# Altium project Arm_Control_Board.PrjPcb (part 1 of 2)
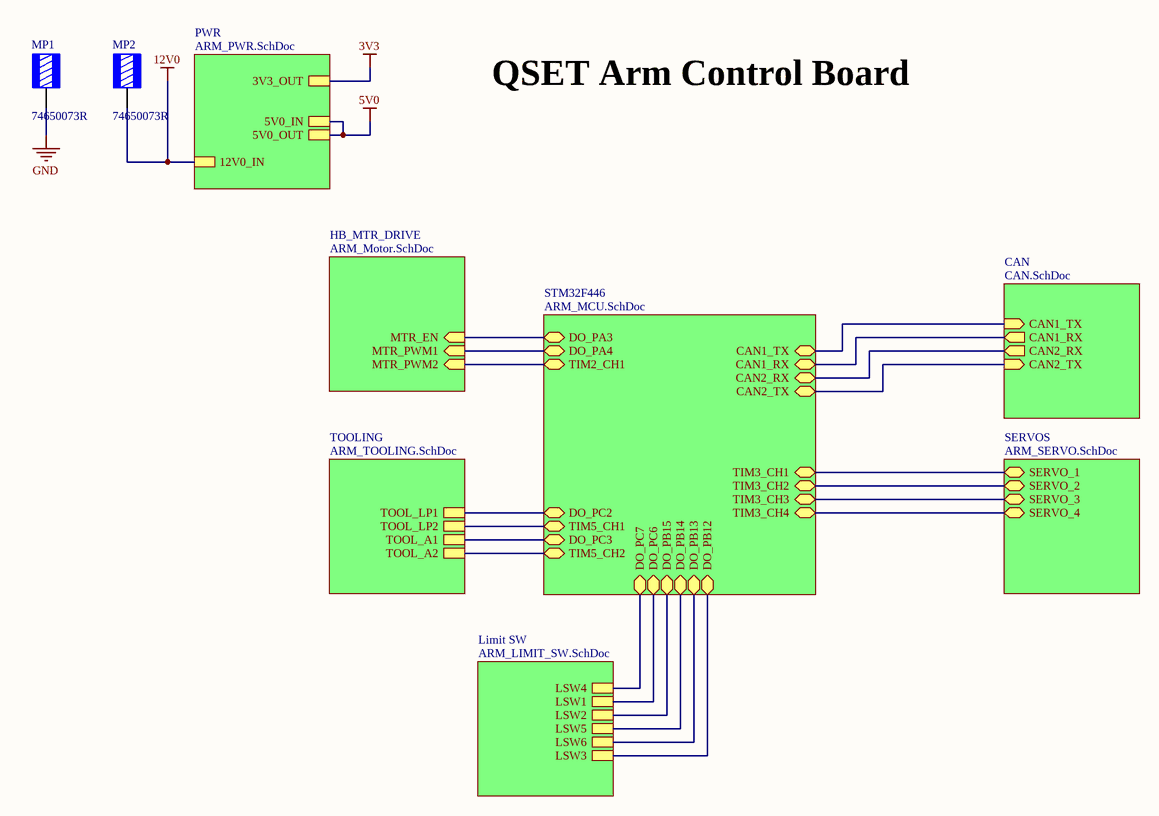
[diagram p0: TOP.SchDoc]
Project: ARM Control Board
9 sheets, 130 parts. Net scope: hierarchical (ports join the sheet entries above them; power ports are global).
Board file: Arm_Control_Board.PcbDoc
Sheets:
  TOP.SchDoc
    STM32F446 = ARM_MCU.SchDoc
      USBC = USBC.SchDoc
    HB_MTR_DRIVE = ARM_Motor.SchDoc
    SERVOS = ARM_SERVO.SchDoc
    PWR = ARM_PWR.SchDoc
    CAN = CAN.SchDoc
    TOOLING = ARM_TOOLING.SchDoc
    Limit SW = ARM_LIMIT_SW.SchDoc

## Sheet TOP.SchDoc: Title
size A4; Date: *******; ApprovedBy: *******; CheckedBy: None; Author: *******; CompanyName: *******; DrawnBy: Jacob Chisholm; Engineer: *******; Organization: *******; Address1: *******; Address2: *******; Address3: *******; Address4: *******; DocumentNumber: 1; Revision: *******; SheetNumber: 1; SheetTotal: 9; Address_Website: https://jchisholm204.github.io; E-Mail: JacobChisholm1010@gmail.com; CurrentTime: *******; CurrentDate: *******; Time: *******; DocumentFullPathAndName: *******; DocumentName: *******; ModifiedDate: *******; ImagePath: *******; ProjectName: *******; Application_BuildNumber: *******

### Parts
MP1  74650073R  [WURTH 74650073]
MP2  74650073R  [WURTH 74650073]

### Sub-sheets
CAN = CAN.SchDoc: CAN1_TX (in), CAN1_RX (out), CAN2_TX (in), CAN2_RX (out)
HB_MTR_DRIVE = ARM_Motor.SchDoc: MTR_EN (in), MTR_PWM1 (in), MTR_PWM2 (in)
Limit SW = ARM_LIMIT_SW.SchDoc: LSW1, LSW3, LSW5, LSW2, LSW4, LSW6
PWR = ARM_PWR.SchDoc: 3V3_OUT, 5V0_IN, 12V0_IN, 5V0_OUT
SERVOS = ARM_SERVO.SchDoc: SERVO_1 (bidir), SERVO_2 (bidir), SERVO_3 (bidir), SERVO_4 (bidir)
STM32F446 = ARM_MCU.SchDoc: TIM5_CH1 (bidir), TIM5_CH2 (bidir), DO_PA3 (bidir), DO_PA4 (bidir), DO_PC6 (bidir), DO_PC7 (bidir), DO_PB15 (bidir), DO_PB14 (bidir), TIM3_CH3 (bidir), TIM3_CH4 (bidir), CAN1_RX (bidir), CAN1_TX (bidir), DO_PB13 (bidir), TIM3_CH2 (bidir), DO_PB12 (bidir), CAN2_RX (bidir), CAN2_TX (bidir), TIM3_CH1 (bidir), TIM2_CH1 (bidir), DO_PC2 (bidir), DO_PC3 (bidir)
TOOLING = ARM_TOOLING.SchDoc: TOOL_LP1, TOOL_LP2, TOOL_A1, TOOL_A2

### Nets
5V0: sheet PWR/5V0_IN, sheet PWR/5V0_OUT
12V0: MP2.1 ; sheet PWR/12V0_IN  [project net 12V_IN]
GND: MP1.1
\: sheet STM32F446/DO_PC7, sheet Limit SW/LSW4
CAN1_RX: sheet STM32F446/CAN1_RX, sheet CAN/CAN1_RX
CAN1_TX: sheet STM32F446/CAN1_TX, sheet CAN/CAN1_TX
CAN2_RX: sheet STM32F446/CAN2_RX, sheet CAN/CAN2_RX
CAN2_TX: sheet STM32F446/CAN2_TX, sheet CAN/CAN2_TX
DO_PA3: sheet STM32F446/DO_PA3, sheet HB_MTR_DRIVE/MTR_EN
DO_PA4: sheet STM32F446/DO_PA4, sheet HB_MTR_DRIVE/MTR_PWM1
DO_PB12: sheet STM32F446/DO_PB12, sheet Limit SW/LSW3
DO_PB13: sheet STM32F446/DO_PB13, sheet Limit SW/LSW6
DO_PB14: sheet STM32F446/DO_PB14, sheet Limit SW/LSW5
DO_PB15: sheet STM32F446/DO_PB15, sheet Limit SW/LSW2
DO_PC2: sheet STM32F446/DO_PC2, sheet TOOLING/TOOL_LP1
DO_PC3: sheet STM32F446/DO_PC3, sheet TOOLING/TOOL_A1
DO_PC6: sheet STM32F446/DO_PC6, sheet Limit SW/LSW1
TIM2_CH2: sheet STM32F446/TIM2_CH1, sheet HB_MTR_DRIVE/MTR_PWM2
TIM3_CH1: sheet STM32F446/TIM3_CH1, sheet SERVOS/SERVO_1
TIM3_CH2: sheet STM32F446/TIM3_CH2, sheet SERVOS/SERVO_2
TIM3_CH3: sheet STM32F446/TIM3_CH3, sheet SERVOS/SERVO_3
TIM3_CH4: sheet STM32F446/TIM3_CH4, sheet SERVOS/SERVO_4
TIM5_CH1: sheet STM32F446/TIM5_CH1, sheet TOOLING/TOOL_LP2
TIM5_CH2: sheet STM32F446/TIM5_CH2, sheet TOOLING/TOOL_A2

### Notes on the sheet
- QSET Arm Control Board
- Title:
- Drawn By:
- Page Contents:
- Checked By:
- Size:
- Date:
- File:
- License:
- Email:
- A4
- Number:
- Time:
- Revision:
- Sheet
- Website:
- of

### Library data of the parts
MP1 MP2 = 74650073R: TERM REDCUBE M3 4PIN PCB; Manufacturer: Würth Elektronik; Current Rating (Amps): 50 A; Part Number: 74650073R; ComponentLink1Description: Datasheet; ComponentLink1URL: https://katalog.we-online.de/em/datasheet/74650073R.pdf; ComponentLink2Description: DigiKey Link; ComponentLink2URL: https://www.digikey.com/en/products/detail/würth-elektronik/74650073R/6643978; Features: Screw not Included; LastUpdated: 8/7/2022 8:38:54 PM; Lifecycle Status: Active; Minimum Order: 1; Mounting Type: Through Hole; Number of Pins: 4; Packaging: TapeAndReel; Part Status: Active; Price: 2.28; Screw Size: M3; Series: REDCUBE WP-THRBU; Supplier 1: DigiKey; Supplier Part Number 1: 732-10882-1-ND; Terminal Type: Screw Terminal, Power Tap; Termination: Solder

## Sheet ARM_MCU.SchDoc: Title
size A4; Date: *******; ApprovedBy: *******; CheckedBy: None; Author: *******; CompanyName: *******; DrawnBy: Jacob Chisholm; Engineer: *******; Organization: *******; Address1: *******; Address2: *******; Address3: *******; Address4: *******; DocumentNumber: 2; Revision: *******; SheetNumber: 2; SheetTotal: 9; Address_Website: https://jchisholm204.github.io; E-Mail: JacobChisholm1010@gmail.com; CurrentTime: *******; CurrentDate: *******; Time: *******; DocumentFullPathAndName: *******; DocumentName: *******; ModifiedDate: *******; ImagePath: *******; ProjectName: *******; Application_BuildNumber: *******
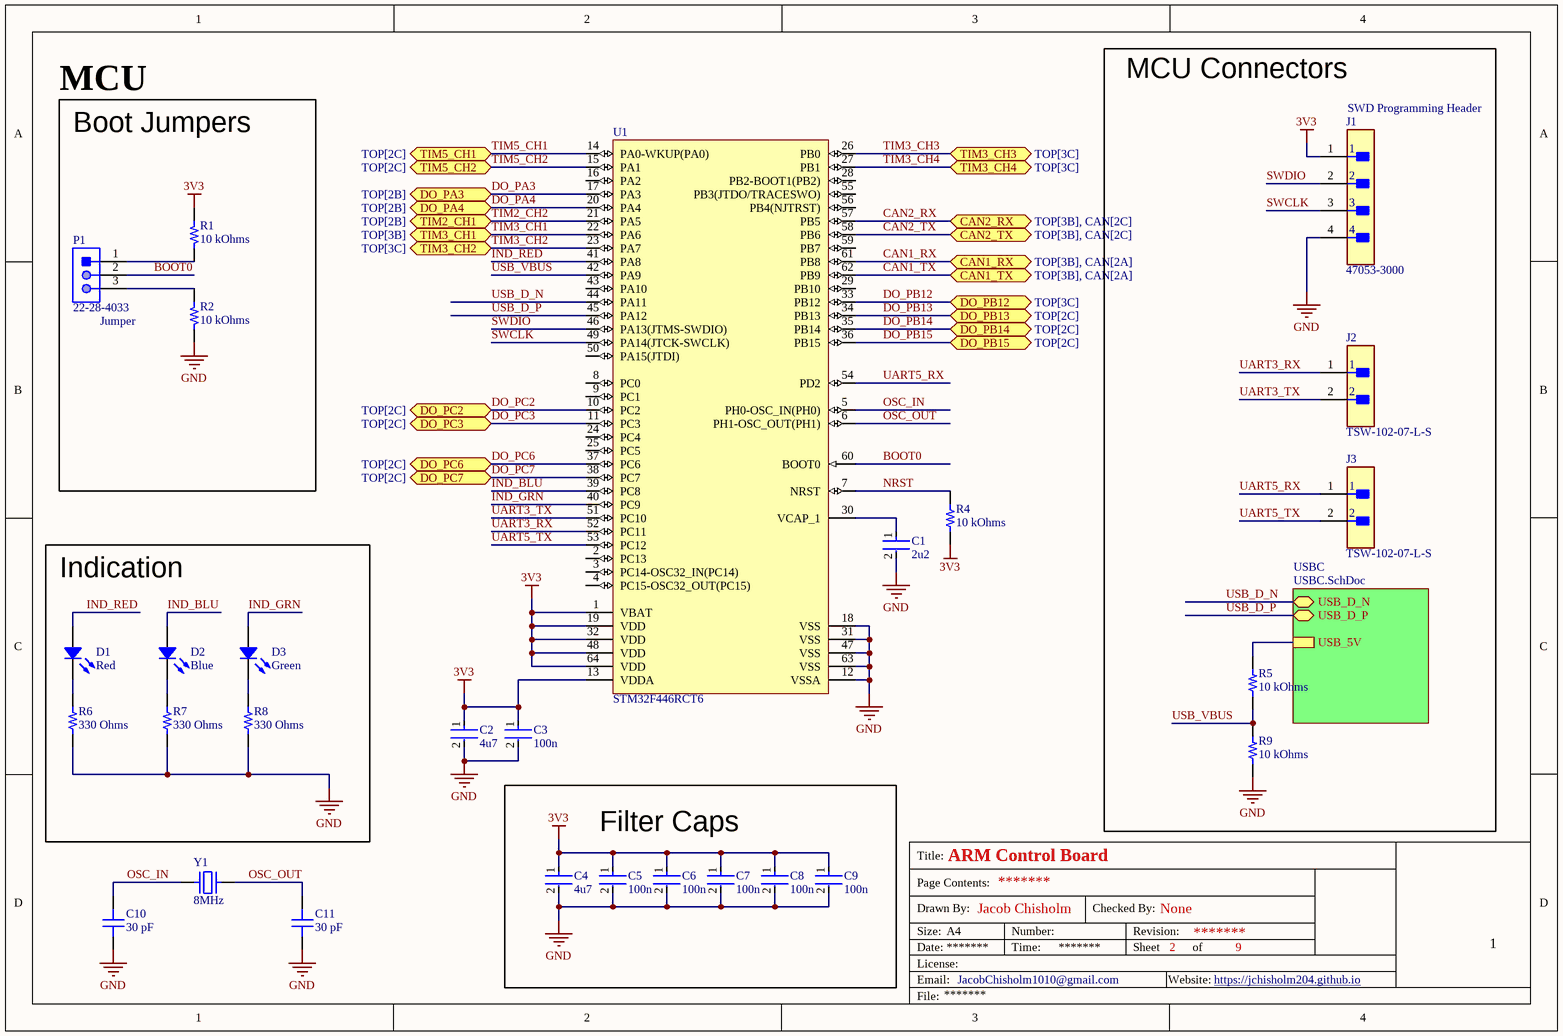
[diagram p1: ARM_MCU.SchDoc]

### Parts
C1  2u2  [FP-CL10-IPC_C]
C2  4u7  [FP-CL10-IPC_C]
C3  100n  [FP-CL779-IPC_C]
C4  4u7  [FP-CL10-IPC_C]
C5  100n  [FP-CL779-IPC_C]
C6  100n  [FP-CL779-IPC_C]
C7  100n  [FP-CL779-IPC_C]
C8  100n  [FP-CL779-IPC_C]
C9  100n  [FP-CL779-IPC_C]
C10  30 pF  [CAP 0603_1608]
C11  30 pF  [CAP 0603_1608]
D1  Red  [LED 0603_1608 RED]
D2  Blue  [LED 0603_1608 BLUE]
D3  Green  [LED 0603_1608 GREEN]
J1  47053-3000  [FP-47053-3000-MFG]
J2  TSW-102-07-L-S  [FP-TSW-102-07-L-S-MFG]
J3  TSW-102-07-L-S  [FP-TSW-102-07-L-S-MFG]
P1  22-28-4033  [MOLX-22-28-4033_V]
R1  10 kOhms  [RES 0603_1608]
R2  10 kOhms  [RES 0603_1608]
R4  10 kOhms  [RES 0603_1608]
R5  10 kOhms  [RES 0603_1608]
R6  330 Ohms  [RES 0603_1608]
R7  330 Ohms  [RES 0603_1608]
R8  330 Ohms  [RES 0603_1608]
R9  10 kOhms  [RES 0603_1608]
U1  STM32F446RCT6  [STM-LQFP64_L]
Y1  8MHz  [TXC 9C]

### Blocks framed on the sheet
MCU Connectors: J1-J3 R5 R9
MCU: P1 R1 R2
Indication: D1-D3 R6-R8
Filter Caps: C4-C9

### Sub-sheets
USBC = USBC.SchDoc: USB_D_N (bidir), USB_D_P (bidir), USB_5V

### Ports
CAN1_RX (bidir, see TOP[3B], CAN[2A]), CAN1_TX (bidir, see TOP[3B], CAN[2A]), CAN2_RX (bidir, see TOP[3B], CAN[2C]), CAN2_TX (bidir, see TOP[3B], CAN[2C]), DO_PA3 (bidir, see TOP[2B]), DO_PA4 (bidir, see TOP[2B]), DO_PB12 (bidir, see TOP[3C]), DO_PB13 (bidir, see TOP[2C]), DO_PB14 (bidir, see TOP[2C]), DO_PB15 (bidir, see TOP[2C]), DO_PC2 (bidir, see TOP[2C]), DO_PC3 (bidir, see TOP[2C]), DO_PC6 (bidir, see TOP[2C]), DO_PC7 (bidir, see TOP[2C]), TIM2_CH1 (bidir, see TOP[2B]), TIM3_CH1 (bidir, see TOP[3B]), TIM3_CH2 (bidir, see TOP[3C]), TIM3_CH3 (bidir, see TOP[3C]), TIM3_CH4 (bidir, see TOP[3C]), TIM5_CH1 (bidir, see TOP[2C]), TIM5_CH2 (bidir, see TOP[2C])

### Nets
3V3: C2.1 C3.1 C4.1 C5.1 C6.1 C7.1 C8.1 C9.1 J1.1 R1.1 R4.1 U1.1(VBAT) U1.13(VDDA) U1.19(VDD) U1.32(VDD) U1.48(VDD) U1.64(VDD)
GND: C1.2 C2.2 C3.2 C4.2 C5.2 C6.2 C7.2 C8.2 C9.2 C10.1 C11.1 J1.4 R2.1 R6.1 R7.1 R8.1 R9.1 U1.12(VSSA) U1.18(VSS) U1.31(VSS) U1.47(VSS) U1.63(VSS)
BOOT0: P1.2 U1.60(BOOT0)
CAN1_RX: U1.61(PB8) ; port CAN1_RX
CAN1_TX: U1.62(PB9) ; port CAN1_TX
CAN2_RX: U1.57(PB5) ; port CAN2_RX
CAN2_TX: U1.58(PB6) ; port CAN2_TX
DO_PA3: U1.17(PA3) ; port DO_PA3
DO_PA4: U1.20(PA4) ; port DO_PA4
DO_PB12: U1.33(PB12) ; port DO_PB12
DO_PB13: U1.34(PB13) ; port DO_PB13
DO_PB14: U1.35(PB14) ; port DO_PB14
DO_PB15: U1.36(PB15) ; port DO_PB15
DO_PC2: U1.10(PC2) ; port DO_PC2
DO_PC3: U1.11(PC3) ; port DO_PC3
DO_PC6: U1.37(PC6) ; port DO_PC6
DO_PC7: U1.38(PC7) ; port DO_PC7  [project net \]
IND_BLU: D2.1 U1.39(PC8)
IND_GRN: D3.1 U1.40(PC9)
IND_RED: D1.1 U1.41(PA8)
NRST: R4.2 U1.7(NRST)
OSC_IN: C10.2 U1.5(PH0-OSC_IN(PH0)) Y1.1
OSC_OUT: C11.2 U1.6(PH1-OSC_OUT(PH1)) Y1.2
SWCLK: J1.3 U1.49(PA14(JTCK-SWCLK))
SWDIO: J1.2 U1.46(PA13(JTMS-SWDIO))
TIM2_CH2: U1.21(PA5) ; port TIM2_CH1
TIM3_CH1: U1.22(PA6) ; port TIM3_CH1
TIM3_CH2: U1.23(PA7) ; port TIM3_CH2
TIM3_CH3: U1.26(PB0) ; port TIM3_CH3
TIM3_CH4: U1.27(PB1) ; port TIM3_CH4
TIM5_CH1: U1.14(PA0-WKUP(PA0)) ; port TIM5_CH1
TIM5_CH2: U1.15(PA1) ; port TIM5_CH2
UART3_RX: J2.1 U1.52(PC11)
UART3_TX: J2.2 U1.51(PC10)
UART5_RX: J3.1 U1.54(PD2)
UART5_TX: J3.2 U1.53(PC12)
USB_D_N: U1.44(PA11) ; sheet USBC/USB_D_N
USB_D_P: U1.45(PA12) ; sheet USBC/USB_D_P
USB_VBUS: R5.1 R9.2 U1.42(PA9)
NetC1_1: C1.1 U1.30(VCAP_1)
NetD1_2: D1.2 R6.2
NetD2_2: D2.2 R7.2
NetD3_2: D3.2 R8.2
NetJ4_A4: R5.2 ; sheet USBC/USB_5V
NetP1_1: P1.1 R1.2
NetP1_3: P1.3 R2.2

Not connected (* = marked no-connect by the designer): U1 2(PC13) 3(PC14-OSC32_IN(PC14)) 4(PC15-OSC32_OUT(PC15)) 8(PC0) 9(PC1) 16(PA2) 24(PC4) 25(PC5) 28(PB2-BOOT1(PB2)) 29(PB10) 43(PA10) 50(PA15(JTDI)) 55(PB3(JTDO/TRACESWO)) 56(PB4(NJTRST)) 59(PB7)

### Notes on the sheet
- (near J1) SWD Programming Header
- Boot Jumpers
- (near P1) Jumper
- 1
- Title:
- Drawn By:
- Page Contents:
- Checked By:
- Size:
- Date:
- File:
- License:
- Email:
- A4
- Number:
- Time:
- Revision:
- Sheet
- Website:
- of

### Library data of the parts
C1 C2 C4 = CMP-13271-003017-1: Cap Ceramic 4.7uF 10V X5R ±10% Pad SMD 0603 +85°C T/R; Capacitance: 4.7uF; Case/Package: 0603; Packaging: Tape and Reel; Width: 0.031inch; Contact Plating: Tin; Thickness: 0.035inch; Package Quantity: 1; Voltage Rating: 10V; Case Code (Metric): 1608; Case Code (Imperial): 0603; Depth: 0.8mm; Height: 0.8mm; Tolerance: 10%; Max Operating Temperature: 85°C; Length: 1.6mm; Dielectric: X5R; Mount: Surface Mount; Radiation Hardening: No; Min Operating Temperature: -55°C
C3 C5-C9 = CMP-13271-002336-1: Cap Ceramic 100nF 50V X7R ±10% SMD 0402 +125°C Paper T/R
C10 C11 = 0603N300J500CT: CAP CER 30PF 50V C0G/NP0 0603; manufacturer: Walsin Technology Corporation; Temperature Coefficient: C0G, NP0; Tolerance: ±5%; Part Number: 0603N300J500CT; Value: 30 pF; Applications: General Purpose; Capacitance: 30 pF; componentlink1description: Datasheet; componentlink1url: http://www.passivecomponent.com/wp-content/uploads/2018/10/MLCC.pdf; componentlink2description: DigiKey Link; componentlink2url: https://www.digikey.com/en/products/detail/walsin-technology-corporation/0603N300J500CT/9355012; Device Package: 0603 (1608 Metric); lastupdated: 2/9/2024 8:10:20 PM; Lifecycle Status: Active; Minimum Order: 1; Mounting Type: Surface Mount, MLCC; Operating Temperature: -55°C ~ 125°C; Package / Case: 0603 (1608 Metric); packaging: TapeAndReel; partid: 9974; Part Status: Active; price: 0.01; series: -; Size / Dimension: 0.063" L x 0.031" W (1.60mm x 0.80mm); Supplier 1: DigiKey; Supplier Part Number 1: 1292-1515-1-ND; Thickness (Max): 0.034" (0.87mm); Voltage - Rated: 50V
D1 = 19-213SDRC/S259/TR8: LED RED CLEAR 2SMD; Manufacturer: Everlight Electronics Co Ltd; Configuration: Standard; Current - Test: 10mA; Lens Color: Colorless; Lens Size: 1.20mm x 0.80mm; Lens Style: Rectangle with Flat Top; Viewing Angle: 120°; Voltage - Forward (Vf) (Typ): 2V; Wavelength - Peak: 650nm; Part Number: 19-213SDRC/S259/TR8; Color: Red; ComponentLink1Description: Datasheet; ComponentLink1URL: //media.digikey.com/pdf/Data%20Sheets/Everlight%20PDFs/19-213SDRC-S259-TR8.pdf; ComponentLink2Description: DigiKey Link; ComponentLink2URL: http://digikey.com/product-detail/en/everlight-electronics-co-ltd/19-213SDRC-S259-TR8/1080-1580-1-ND/8535303; Device Package: 0603 (1608 Metric); Height (Max): 0.70mm; LastUpdated: 6/3/2024 7:59:48 PM; Lens Transparency: Clear; Lifecycle Status: Active; Minimum Order: 1; Mounting Type: Surface Mount; Package / Case: 0603 (1608 Metric); Packaging: TapeAndReel; PartId: 372; Part Status: Active; Price: 0.06; Series: -; Size / Dimension: 1.60mm L x 0.80mm W; Supplier 1: DigiKey; Supplier Part Number 1: 1080-1580-1-ND; Supplier Device Package: 2-SMD; Value: Red
D2 = 19-213SUBC/S400-A5/S208-2/TR8: LED BLUE CLEAR 2SMD; Manufacturer: Everlight Electronics Co Ltd; Configuration: Standard; Current - Test: 5mA; Lens Color: Colorless; Lens Size: 1.20mm x 0.80mm; Lens Style: Rectangle with Flat Top; Viewing Angle: 120°; Voltage - Forward (Vf) (Typ): 2.9V; Wavelength - Peak: 468nm; Part Number: 19-213SUBC/S400-A5/S208-2/TR8; Color: Blue; ComponentLink1Description: Datasheet; ComponentLink1URL: //media.digikey.com/pdf/Data%20Sheets/Everlight%20PDFs/19-213SUBC-S400-A5-S208-2-TR8.pdf; ComponentLink2Description: DigiKey Link; ComponentLink2URL: https://www.digikey.com/en/products/detail/everlight-electronics-co-ltd/19-213SUBC-S400-A5-S208-2-TR8/8535275; Device Package: 0603 (1608 Metric); Height (Max): 0.70mm; LastUpdated: 6/3/2024 7:57:52 PM; Lens Transparency: Clear; Lifecycle Status: Active; Minimum Order: 1; Mounting Type: Surface Mount; Package / Case: 0603 (1608 Metric); Packaging: TapeAndReel; PartId: 808; Part Status: Active; Price: 0.05; Series: -; Size / Dimension: 1.60mm L x 0.80mm W; Supplier 1: DigiKey; Supplier Part Number 1: 1080-1581-1-ND; Supplier Device Package: 2-SMD; Value: Blue
D3 = 150060GS55040: LED GREEN DIFFUSED 0603 SMD; Manufacturer: Würth Elektronik; Configuration: Standard; Current - Test: 20mA; Lens Color: 0.50mm; Lens Size: 1.00mm x 0.80mm; Lens Style: Rectangle with Flat Top; Millicandela Rating: 430mcd; Viewing Angle: 140°; Voltage - Forward (Vf) (Typ): 3.2V; Wavelength - Dominant: 525nm; Wavelength - Peak: 520nm; Part Number: 150060GS55040; Color: Green; ComponentLink1Description: Datasheet; ComponentLink1URL: https://www.we-online.de/web/en/index.php/download/media/07_electronic_components/download_center_1/application_notes_berichte/ano002_leds___the_future_of_horticultural_lighting/ANO002b_EN_LEDs_The_Future_of_Horticultural_Lighting.pdf; ComponentLink2Description: DigiKey Link; ComponentLink2URL: https://www.digikey.com/en/products/detail/würth-elektronik/150060GS55040/8557179; Device Package: 0603 (1608 Metric); Height (Max): 0.50mm; LastUpdated: 6/3/2024 7:58:52 PM; Lens Transparency: Diffused; Lifecycle Status: Active; Minimum Order: 1; Mounting Type: Surface Mount; Package / Case: 0603 (1608 Metric); Packaging: TapeAndReel; PartId: 673; Part Status: Active; Price: 0.14; Series: WL-SMCD; Size / Dimension: 1.60mm L x 0.80mm W; Supplier 1: DigiKey; Supplier Part Number 1: 732-12014-1-ND; Supplier Device Package: 0603 (1608 Metric); Value: Green
J1 = CMP-04776-000447-1: CONN HEADER VERT 4POS 2.54MM; Glow Wire Compliant: Non-compliant; Voltage Rating: 250V; Current Rating: 4A; Number of Circuits: 4; Gender: Male; Orientation: Straight; Packaging: Bulk; Series: 47053; RoHS Compliant: Yes; Termination: Through Hole; Contact Plating: Tin; Mount: Through Hole; Number of Rows: 1; Pitch: 2.54mm; Halogen Free: Low Halogen; Number of Contacts: 4; Min Operating Temperature: 0°C; Package Quantity: 12000; Contact Material: Copper Alloy; Max Operating Temperature: 75°C; REACH SVHC: No SVHC; Number of Positions: 4
J2 J3 = CMP-02766-001428-1: CONN HEADER VERT 2POS 2.54MM; Voltage Rating: 550V; Current Rating: 7.6A; Gender: Male; Number of Contacts: 2; Connector Type: Male Pin; Radiation Hardening: No; Orientation: Straight; Contact Plating: Gold; Max Operating Temperature: 125°C; Mount: Through Hole; Package Quantity: 1; Number of Rows: 1; Housing Material: Polyester; RoHS Compliant: Yes; Length: 5.08mm; Max Voltage Rating (AC): 550V; Pitch: 2.54mm; Packaging: Bulk; Depth: 2.54mm; Termination: Solder; Min Operating Temperature: -55°C; Housing Color: Black; Lead Free: Lead Free; Color: Black; Number of Positions: 2; Width: 2.54mm; Max Current Rating: 7.6A; REACH SVHC: No SVHC; Contact Material: Bronze; Contact Mating Length: 0.23inch; Series: TSW; Contact Type: Male Pin
P1 = CMP-1676-00001-5: Male Header, Pitch 2.54 mm, 1 x 3 Position, Height 8.38 mm, Tail Length 3.18 mm, RoHS, Bulk; Manufacturer: Molex; Rows: 1; Voltage Rating: 250 V; Current Rating: 4 A; Min Operating Temperature: 0 degC; Lead Pitch: 0.1 inch; Packaging: Bulk; Contact Finish: Gold; RoHSCompliant: true; Contact Material: Brass; PackageReference: 22-28-4033; REACH SVHC: Unknown; PackageDescription: Male Header, Pitch 2.54 mm, 1 x 3 Position, Height 8.38 mm, Tail Length 3.18 mm; ComponentLink2URL: http://www.molex.com/pdm_docs/sd/022284033_sd.pdf; Height: 8.38 mm; Mounting Technology: Through Hole; ComponentLink1Description: Manufacturer URL; Length: 7.62 mm; Mount: Through Hole; DatasheetVersion: Rev. G, 01/2012; Max Operating Temperature: 75 degC; ComponentLink2Description: Datasheet; Colour: Black; Pins: 3; Contact Plating: Gold; Package Quantity: 1; ComponentLink1URL: http://www.molex.com/
R1 R2 R4 = P2TC0603D1002LNTA: P2TC0603 2PPM/C 10K 0,01% N TA; Manufacturer: Vishay Sfernice; Power (Watts): 0.125W, 1/8W; Temperature Coefficient: ±2ppm/°C; Tolerance: ±0.01%; Part Number: P2TC0603D1002LNTA; Value: 10 kOhms; ComponentLink1Description: Datasheet; ComponentLink1URL: https://www.vishay.com/docs/53080/p2tc.pdf; ComponentLink2Description: DigiKey Link; ComponentLink2URL: https://www.digikey.com/en/products/detail/vishay-sfernice/P2TC0603D1002LNTA/11657673; Composition: Thin Film; Device Package: 0603 (1608 Metric); Features: Anti-Sulfur, Moisture Resistant; Height - Seated (Max): 0.025" (0.63mm); LastUpdated: 2/9/2024 8:41:20 PM; Lifecycle Status: Active; Minimum Order: 1; Number of Terminations: 2; Operating Temperature: -55°C ~ 155°C; Package / Case: 0603 (1608 Metric); Packaging: TapeAndReel; PartId: 62108; Part Status: Active; Price: 11.51; Resistance: 10 kOhms; Series: P2TC; Size / Dimension: 0.060" L x 0.033" W (1.52mm x 0.85mm); Supplier 1: DigiKey; Supplier Part Number 1: 716-P2TC0603D1002LNTACT-ND; Supplier Device Package: 0603
R5 R9 = APC0603B10K0N: 1/16 WATTS PRECISION CHIP 10 KIL; Manufacturer: Ohmite; Power (Watts): 0.063W, 1/16W; Temperature Coefficient: ±25ppm/°C; Tolerance: ±0.1%; Part Number: APC0603B10K0N; Value: 10 kOhms; ComponentLink1Description: Datasheet; ComponentLink1URL: https://www.ohmite.com/assets/docs/APC-1-15.34.pdf; ComponentLink2Description: DigiKey Link; ComponentLink2URL: https://www.digikey.com/en/products/detail/ohmite/APC0603B10K0N/16369646; Composition: Thin Film; Device Package: 0603 (1608 Metric); Height - Seated (Max): 0.022" (0.55mm); LastUpdated: 2/9/2024 8:40:41 PM; Lifecycle Status: Active; Minimum Order: 1; Number of Terminations: 2; Operating Temperature: -55°C ~ 155°C; Package / Case: 0603 (1608 Metric); Packaging: TapeAndReel; PartId: 77923; Part Status: Active; Price: 0.05; Resistance: 10 kOhms; Series: APC; Size / Dimension: 0.061" L x 0.031" W (1.55mm x 0.80mm); Supplier 1: DigiKey; Supplier Part Number 1: 273-APC0603B10K0NCT-ND; Supplier Device Package: 0603
R6-R8 = RCC0603330RFKEA: RCC0603 100 330R 1% ET1 E3; Manufacturer: Vishay Dale; Power (Watts): 0.2W, 1/5W; Temperature Coefficient: ±100ppm/°C; Part Number: RCC0603330RFKEA; Value: 330 Ohms; ComponentLink1Description: Datasheet; ComponentLink1URL: https://www.vishay.com/docs/20066/rcce3.pdf; ComponentLink2Description: DigiKey Link; ComponentLink2URL: https://www.digikey.com/en/products/detail/vishay-dale/RCC0603330RFKEA/12084212; Composition: Thick Film; Device Package: 0603 (1608 Metric); Features: Automotive AEC-Q200; Height - Seated (Max): 0.020" (0.50mm); LastUpdated: 2/9/2024 8:41:26 PM; Lifecycle Status: Active; Minimum Order: 1; Number of Terminations: 2; Operating Temperature: -55°C ~ 155°C; Package / Case: 0603 (1608 Metric); Packaging: TapeAndReel; PartId: 62920; Part Status: Active; Price: 0.01; Ratings: AEC-Q200; Resistance: 330 Ohms; Series: RCC e3; Size / Dimension: 0.061" L x 0.033" W (1.55mm x 0.85mm); Supplier 1: DigiKey; Supplier Part Number 1: 541-RCC0603330RFKEACT-ND; Supplier Device Package: 0603; Tolerance: ±1%
U1 = CMP-0243-00216-1: ARM Cortex-M4 32-bit MCU+FPU, 256 KB Flash, 128 KB Internal RAM, 50 I/Os, 64-Pin LQFP, -40 to 85 degC, Tray; Operating Frequency(F) (Processor speed) (MHz): 180; Internal RAM Size (kB): 128; I/Os (High Current): 50; FLASH Size (Prog) (kB): 256; D/A Converter: 2; Supply Voltage(Vcc) min (V): 1.7; Mounting Technology: Surface Mount; DatasheetVersion: Rev. 6; ComponentLink1URL: http://www.st.com/; Package Description: LQFP64; ComponentLink1Description: Manufacturer URL; Packing: Tray; ComponentLink2Description: Datasheet; Core: ARM Cortex-M4; Package Reference: 64-Pin Low-profile Quad Flat Package, Body 10 x 10 mm, Pitch 0.5 mm; ComponentLink2URL: http://www.st.com/st-web-ui/static/active/en/resource/technical/document/datasheet/DM00141306.pdf
Y1 = 9C-8.000MBBK-T: CRYSTAL 8.0000MHZ 20PF SMD; Manufacturer: TXC CORPORATION; ESR (Equivalent Series Resistance): 80 Ohms; Frequency Stability: ±50ppm; Operating Mode: Fundamental; Part Number: 9C-8.000MBBK-T; ComponentLink1Description: Datasheet; ComponentLink1URL: http://www.txccorp.com/download/products/quartz_crystals/2015TXC_9C_32.pdf; ComponentLink2Description: DigiKey Link; ComponentLink2URL: http://digikey.com/product-detail/en/txc-corporation/9C-8.000MBBK-T/887-2475-1-ND/4475454; Frequency: 8MHz; Frequency Tolerance: ±50ppm; Height - Seated (Max): 0.161" (4.10mm); LastUpdated: 6/3/2024 8:02:24 PM; Lifecycle Status: Active; Load Capacitance: 20pF; Minimum Order: 1; Mounting Type: Surface Mount; Operating Temperature: -20°C ~ 70°C; Package / Case: HC-49S; Packaging: TapeAndReel; PartId: 697; Part Status: Active; Price: 0.18; Series: 9C; Size / Dimension: 0.449" L x 0.189" W (11.40mm x 4.80mm); Supplier 1: DigiKey; Supplier Part Number 1: 887-2475-1-ND; Type: MHz Crystal; Value: 8MHz

## Sheet USBC.SchDoc: Title
size A4; Date: *******; ApprovedBy: *******; CheckedBy: None; Author: *******; CompanyName: *******; DrawnBy: Jacob Chisholm; Engineer: *******; Organization: *******; Address1: *******; Address2: *******; Address3: *******; Address4: *******; DocumentNumber: 3; Revision: *******; SheetNumber: 3; SheetTotal: 9; Address_Website: https://jchisholm204.github.io; E-Mail: JacobChisholm1010@gmail.com; CurrentTime: *******; CurrentDate: *******; Time: *******; DocumentFullPathAndName: *******; DocumentName: *******; ModifiedDate: *******; ImagePath: *******; ProjectName: *******; Application_BuildNumber: *******
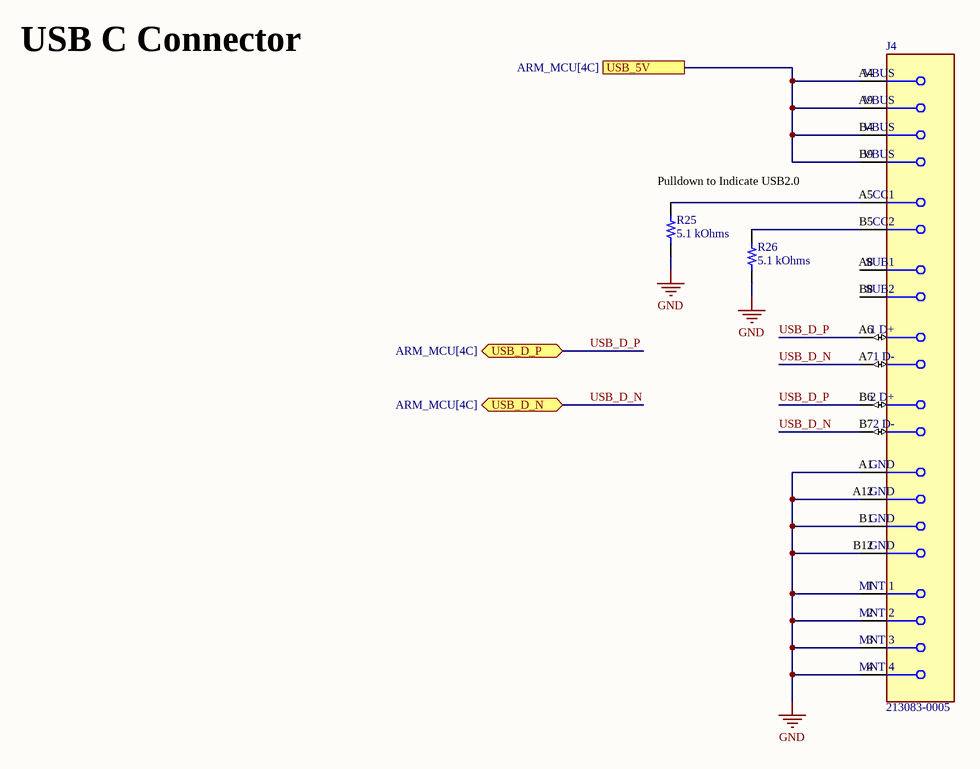
[diagram p2: USBC.SchDoc]

### Parts
J4  213083-0005  [FP-2130830005-MFG]
R25  5.1 kOhms  [RES 0603_1608]
R26  5.1 kOhms  [RES 0603_1608]

### Ports
USB_5V (see ARM_MCU[4C]), USB_D_N (bidir, see ARM_MCU[4C]), USB_D_P (bidir, see ARM_MCU[4C])

### Nets
GND: J4.1(MNT_1) J4.2(MNT_2) J4.3(MNT_3) J4.4(MNT_4) J4.A1(GND) J4.A12(GND) J4.B1(GND) J4.B12(GND) R25.1 R26.1
USB_D_N: J4.A7(1_D-) J4.B7(2_D-) ; port USB_D_N
USB_D_P: J4.A6(1_D+) J4.B6(2_D+) ; port USB_D_P
NetJ4_A4: J4.A4(VBUS) J4.A9(VBUS) J4.B4(VBUS) J4.B9(VBUS) ; port USB_5V
NetJ4_A5: J4.A5(CC1) R25.2
NetJ4_B5: J4.B5(CC2) R26.2

Not connected (* = marked no-connect by the designer): J4 A8(SUB1) B8(SUB2)

### Notes on the sheet
- USB C Connector
- (near R25) Pulldown to Indicate USB2.0
- Title:
- Drawn By:
- Page Contents:
- Checked By:
- Size:
- Date:
- File:
- License:
- Email:
- A4
- Number:
- Time:
- Revision:
- Sheet
- Website:
- of

### Library data of the parts
J4 = CMP-04767-000030-2: CONN RCP USB2.0 TYP C 24P SMD RA; NexarPartId: 114105384; Current Rating: 5A; Number of Contacts: 16; Voltage Rating: 30V; Gender: Receptacle; Min Operating Temperature: -40°C; USB Standard: USB 2.0; Max Operating Temperature: 85°C; Contact Material: Gold, Nickel; Schedule B: 8536695050, 8536695050; Country of Origin: CN
R25 R26 = TNPW06035K10BYEN: RES 5.1K OHM 0.1% 1/10W 0603; Manufacturer: Vishay Dale; Power (Watts): 0.125W, 1/8W; Temperature Coefficient: ±10ppm/°C; Part Number: TNPW06035K10BYEN; Value: 5.1 kOhms; ComponentLink1Description: Datasheet; ComponentLink1URL: http://www.vishay.com/docs/28758/tnpw_e3.pdf; ComponentLink2Description: DigiKey Link; ComponentLink2URL: http://digikey.com/product-detail/en/vishay-dale/TNPW06035K10BYEN/541-9831-1-ND/9562456; Composition: Thin Film; Device Package: 0603 (1608 Metric); Features: Anti-Sulfur, Automotive AEC-Q200, Moisture Resistant; Height - Seated (Max): 0.022" (0.55mm); LastUpdated: 2/9/2024 8:43:35 PM; Lifecycle Status: Active; Minimum Order: 1; Number of Terminations: 2; Operating Temperature: -55°C ~ 155°C; Package / Case: 0603 (1608 Metric); Packaging: TapeAndReel; PartId: 5273; Part Status: Active; Price: 0.27; Ratings: AEC-Q200; Resistance: 5.1 kOhms; Series: TNPW e3; Size / Dimension: 0.061" L x 0.033" W (1.55mm x 0.85mm); Supplier 1: DigiKey; Supplier Part Number 1: 541-9831-1-ND; Supplier Device Package: 0603; Tolerance: ±0.1%

## Sheet ARM_Motor.SchDoc: Title
size A4; Date: *******; ApprovedBy: *******; CheckedBy: None; Author: *******; CompanyName: *******; DrawnBy: Jacob Chisholm; Engineer: *******; Organization: *******; Address1: *******; Address2: *******; Address3: *******; Address4: *******; DocumentNumber: 4; Revision: *******; SheetNumber: 4; SheetTotal: 9; Address_Website: https://jchisholm204.github.io; E-Mail: JacobChisholm1010@gmail.com; CurrentTime: *******; CurrentDate: *******; Time: *******; DocumentFullPathAndName: *******; DocumentName: *******; ModifiedDate: *******; ImagePath: *******; ProjectName: *******; Application_BuildNumber: *******
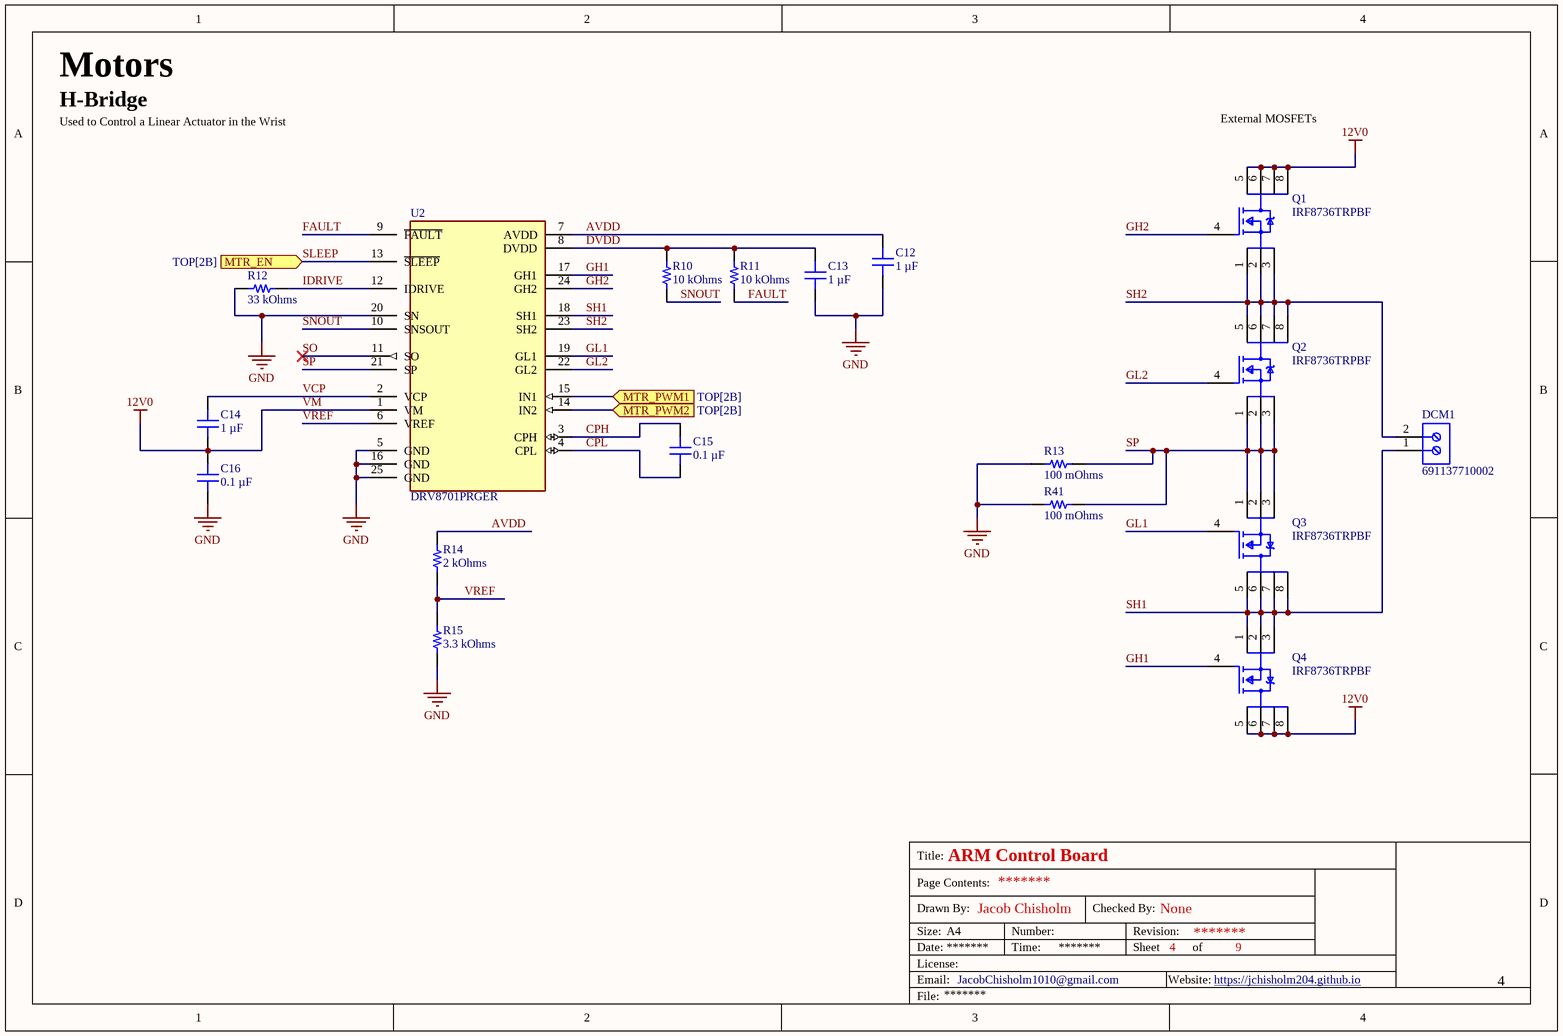
[diagram p3: ARM_Motor.SchDoc]

### Parts
C12  1 µF  [CAP 0603_1608]
C13  1 µF  [CAP 0603_1608]
C14  1 µF  [CAP 0603_1608]
C15  0.1 µF  [CAP 0603_1608]
C16  0.1 µF  [CAP 0603_1608]
DCM1  691137710002  [691137710002]
Q1  IRF8736TRPBF  [FP-PG-DSO-8-MFG]
Q2  IRF8736TRPBF  [FP-PG-DSO-8-MFG]
Q3  IRF8736TRPBF  [FP-PG-DSO-8-MFG]
Q4  IRF8736TRPBF  [FP-PG-DSO-8-MFG]
R10  10 kOhms  [RES 0603_1608]
R11  10 kOhms  [RES 0603_1608]
R12  33 kOhms  [RES 0603_1608]
R13  100 mOhms  [RES 2512_6432]
R14  2 kOhms  [RES 0603_1608]
R15  3.3 kOhms  [RES 0603_1608]
R41  100 mOhms  [RES 2512_6432]
U2  DRV8701PRGER  [FP-RGE0024F-MFG]

### Ports
MTR_EN (in, see TOP[2B]), MTR_PWM1 (in, see TOP[2B]), MTR_PWM2 (in, see TOP[2B])

### Nets
12V0: C14.1 C16.2 Q1.5(D) Q1.6(D) Q1.7(D) Q1.8(D) Q4.5(D) Q4.6(D) Q4.7(D) Q4.8(D) U2.1(VM)  [also labelled VM]  [project net 12V_IN]
GND: C12.1 C13.1 C16.1 R12.2 R13.1 R15.1 R41.1 U2.5(GND) U2.16(GND) U2.20(SN) U2.25(GND)
AVDD: C12.2 R14.2 U2.7(AVDD)
CPH: C15.2 U2.3(CPH)
CPL: C15.1 U2.4(CPL)
DO_PA4: U2.15(IN1) ; port MTR_PWM1
DVDD: C13.2 R10.2 R11.2 U2.8(DVDD)
FAULT: R11.1 U2.9(~{FAULT})
GH1: Q4.4(G) U2.17(GH1)
GH2: Q1.4(G) U2.24(GH2)
GL1: Q3.4(G) U2.19(GL1)
GL2: Q2.4(G) U2.22(GL2)
IDRIVE: R12.1 U2.12(IDRIVE)
SH1: DCM1.1 Q3.5(D) Q3.6(D) Q3.7(D) Q3.8(D) Q4.1(S) Q4.2(S) Q4.3(S) U2.18(SH1)
SH2: DCM1.2 Q1.1(S) Q1.2(S) Q1.3(S) Q2.5(D) Q2.6(D) Q2.7(D) Q2.8(D) U2.23(SH2)
SLEEP: U2.13(~{SLEEP}) ; port MTR_EN  [project net DO_PA3]
SNOUT: R10.1 U2.10(SNSOUT)
SO: U2.11(SO)
SP: Q2.1(S) Q2.2(S) Q2.3(S) Q3.1(S) Q3.2(S) Q3.3(S) R13.2 R41.2 U2.21(SP)
TIM2_CH2: U2.14(IN2) ; port MTR_PWM2
VCP: C14.2 U2.2(VCP)
VREF: R14.1 R15.2 U2.6(VREF)

### Notes on the sheet
- Motors
- H-Bridge
- Used to Control a Linear Actuator in the Wrist
- External MOSFETs
- 4
- Title:
- Drawn By:
- Page Contents:
- Checked By:
- Size:
- Date:
- File:
- License:
- Email:
- A4
- Number:
- Time:
- Revision:
- Sheet
- Website:
- of

### Library data of the parts
C12-C14 = GMC10X7R105K50NT: CAP0603 X7R 1UF 10% 50V; manufacturer: Cal-Chip Electronics, Inc.; Part Number: GMC10X7R105K50NT; Value: 1 µF; Applications: General Purpose; Capacitance: 1 µF; componentlink1description: Datasheet; componentlink1url: https://88ce57.p3cdn1.secureserver.net/wp-content/uploads/2023/01/gmc_series-2.pdf; componentlink2description: DigiKey Link; componentlink2url: https://www.digikey.com/en/products/detail/cal-chip-electronics-inc/GMC10X7R105K50NT/18151141; Device Package: 0603 (1608 Metric); lastupdated: 2/9/2024 8:09:39 PM; Lifecycle Status: Active; Minimum Order: 1; Mounting Type: Surface Mount, MLCC; Operating Temperature: -55°C ~ 125°C; Package / Case: 0603 (1608 Metric); packaging: TapeAndReel; partid: 49828; Part Status: Active; price: 0.03; series: GMC; Size / Dimension: 0.063" L x 0.031" W (1.60mm x 0.80mm); Supplier 1: DigiKey; Supplier Part Number 1: 4713-GMC10X7R105K50NTCT-ND; Temperature Coefficient: X7R; Thickness (Max): 0.037" (0.95mm); Tolerance: ±10%; Voltage - Rated: 50V
C15 C16 = GMC10X7R104K25NT: CAP0603 X7R .1UF 10% 25V; manufacturer: Cal-Chip Electronics, Inc.; Part Number: GMC10X7R104K25NT; Value: 0.1 µF; Applications: General Purpose; Capacitance: 0.1 µF; componentlink1description: Datasheet; componentlink1url: https://88ce57.p3cdn1.secureserver.net/wp-content/uploads/2023/01/gmc_series-2.pdf; componentlink2description: DigiKey Link; componentlink2url: https://www.digikey.com/en/products/detail/cal-chip-electronics-inc/GMC10X7R104K25NT/19910724; Device Package: 0603 (1608 Metric); lastupdated: 2/9/2024 8:08:39 PM; Lifecycle Status: Active; Minimum Order: 1; Mounting Type: Surface Mount, MLCC; Operating Temperature: -55°C ~ 125°C; Package / Case: 0603 (1608 Metric); packaging: TapeAndReel; partid: 56631; price: 0.01; series: GMC; Size / Dimension: 0.063" L x 0.031" W (1.60mm x 0.80mm); Supplier 1: DigiKey; Supplier Part Number 1: 4713-GMC10X7R104K25NTCT-ND; Temperature Coefficient: X7R; Thickness (Max): 0.035" (0.90mm); Tolerance: ±10%; Voltage - Rated: 25V
DCM1 = CMP-1502-03324-2: NexarPartId: 78871135; Voltage Rating: 300V; Number of Contacts: 2; Current Rating: 16A; Lead Pitch: 5mm; Height: 11.6mm; Packaging: Box; RoHS: Non-Compliant; Contact Material: Nickel, Tin; Max Operating Temperature: 120°C; Number of Pins: 2; Min Operating Temperature: -30°C; Number of Rows: 1
Q1-Q4 = CMP-32901-000123-1: MOSFET N-CH 30V 18A 8-SOIC; Manufacturer: Infineon; Depletion Mode: False; Max Junction Temp: +150°C; Reverse Recovery Charge: 19nC; Power Dissipation: 2.5W; Threshold Vgs Max: 2.35V; Number Of Channels: 1; Standoff Height: 0.1mm; Reverse Recovery Time: 16ns; Turn On Delay Time: 12ns; Gate To Source Voltage: 20V; Turn Off Delay Time: 13ns; Input Capacitace At Vds: 2315pF @ 15V; Gate Charge At Vgs: 17nC @ 4.5V; Rthja Max: 50°C/W; Description: N-Channel 30V 18A (Ta) 2.5W (Ta) Surface Mount 8-SO; Max Forward Diode Voltage: 1V; Drain To Source Resistance: 5.5mΩ; Pulse Drain Current: 144A; Threshold Vgs Min: 1.35V; Digikey Description: MOSFET N-CH 30V 18A 8-SOIC; Temperature Range Low: -55°C; Ipc Land Pattern Name: SOIC127P600X155-8; Octopart: https://octopart.com/irf8736trpbf-infineon-65873731; Device Class L2: Transistors; Drain To Source Voltage: 30V; Drain To Source Breakdown Voltage: 30V; Device Class L3: MOSFETs; Category: Trans; Footprint Url: https://www.infineon.com/dgdl/po-so8.pdf?fileId=5546d462580663ef0158068a1275014d; Package: PG-DSO-8; Device Class L1: Discrete Semiconductors; Automotive: No; Manufacturer Part Number: IRF8736TRPBF; Temperature: -55°C to +150°C; Height: 1.75mm; RoHS: TRUE; ComponentLink2URL: https://www.infineon.com/dgdl/irf8736pbf.pdf?fileId=5546d462533600a40153560d9e661d7f; Number Of N Channels: 1; ComponentLink2Description: Datasheet; Continuous Drain Current: 18A; Lead Free: Yes; Temperature Range High: +150°C
R10 R11 = RNCF0603TKW10K0: RES 10K OHM 0.01% 1/10W 0603; Manufacturer: Stackpole Electronics Inc; Power (Watts): 0.1W, 1/10W; Temperature Coefficient: ±2ppm/°C; Part Number: RNCF0603TKW10K0; Value: 10 kOhms; ComponentLink1Description: Datasheet; ComponentLink1URL: https://www.seielect.com/catalog/sei-rncf.pdf; ComponentLink2Description: DigiKey Link; ComponentLink2URL: https://www.digikey.com/en/products/detail/stackpole-electronics-inc/RNCF0603TKW10K0/10290270; Composition: Thin Film; Device Package: 0603 (1608 Metric); Features: Automotive AEC-Q200; Height - Seated (Max): 0.022" (0.55mm); LastUpdated: 2/9/2024 8:43:10 PM; Lifecycle Status: Active; Minimum Order: 1; Number of Terminations: 2; Operating Temperature: -55°C ~ 155°C; Package / Case: 0603 (1608 Metric); Packaging: TapeAndReel; PartId: 11561; Part Status: Active; Price: 1.24; Ratings: AEC-Q200; Resistance: 10 kOhms; Series: RNCF; Size / Dimension: 0.061" L x 0.031" W (1.55mm x 0.80mm); Supplier 1: DigiKey; Supplier Part Number 1: RNCF0603TKW10K0CT-ND; Supplier Device Package: 0603; Tolerance: ±0.01%
R12 = ERJ-H3ED3302V: RES 33K OHM 0.5% 1/8W 0603; Manufacturer: Panasonic Electronic Components; Power (Watts): 0.125W, 1/8W; Temperature Coefficient: ±100ppm/°C; Part Number: ERJ-H3ED3302V; Value: 33 kOhms; ComponentLink1Description: Datasheet; ComponentLink1URL: https://b2b-api.panasonic.eu/file_stream/pids/fileversion/236250; ComponentLink2Description: DigiKey Link; ComponentLink2URL: https://www.digikey.com/en/products/detail/panasonic-electronic-components/ERJ-H3ED3302V/13877675; Composition: Thick Film; Device Package: 0603 (1608 Metric); Features: Automotive AEC-Q200; Height - Seated (Max): 0.022" (0.55mm); LastUpdated: 2/9/2024 8:41:37 PM; Lifecycle Status: Active; Minimum Order: 1; Number of Terminations: 2; Operating Temperature: -55°C ~ 175°C; Package / Case: 0603 (1608 Metric); Packaging: TapeAndReel; PartId: 63754; Part Status: Active; Price: 0.03; Ratings: AEC-Q200; Resistance: 33 kOhms; Series: ERJ-H3E; Size / Dimension: 0.063" L x 0.031" W (1.60mm x 0.80mm); Supplier 1: DigiKey; Supplier Part Number 1: 10-ERJ-H3ED3302VCT-ND; Supplier Device Package: 0603; Tolerance: ±0.5%
R13 R41 = CSR2512C0R1F: RES 0.1 OHM 1% 3W 2512; manufacturer: Riedon; Temperature Coefficient: ±50ppm/°C; Part Number: CSR2512C0R1F; componentlink1description: Datasheet; componentlink1url: https://riedon.com/media/pdf/CSR.pdf; componentlink2description: DigiKey Link; componentlink2url: http://digikey.com/product-detail/en/riedon/CSR2512C0R1F/696-1680-1-ND/5723668; Composition: Metal Element; Device Package: 2512 (6432 Metric); Features: Current Sense, Non-Inductive; Height - Seated (Max): 0.035" (0.90mm); lastupdated: 6/3/2024 8:19:22 PM; Lifecycle Status: Active; Minimum Order: 1; Number of Terminations: 2; Operating Temperature: -55°C ~ 170°C; Package / Case: 2512 (6432 Metric); packaging: TapeAndReel; Part Status: Active; Power (Watts): 3W; price: 0.18; Resistance: 100 mOhms; series: CSR; Size / Dimension: 0.250" L x 0.118" W (6.35mm x 3.00mm); Supplier 1: DigiKey; Supplier Part Number 1: 696-1680-1-ND; Supplier Device Package: 2512; Tolerance: ±1%; value: 100 mOhms
R14 = PTN0603Y2001BST1: PTN0603 10PPM 2K 0.1% S T1 E1; Manufacturer: Vishay Dale Thin Film; Power (Watts): 0.15W; Temperature Coefficient: ±10ppm/°C; Part Number: PTN0603Y2001BST1; Value: 2 kOhms; ComponentLink1Description: Datasheet; ComponentLink1URL: https://www.vishay.com/docs/60026/ptn.pdf; ComponentLink2Description: DigiKey Link; ComponentLink2URL: https://www.digikey.com/en/products/detail/vishay-dale-thin-film/PTN0603Y2001BST1/12820639; Composition: Thin Film; Device Package: 0603 (1608 Metric); Features: Anti-Sulfur, Moisture Resistant, Non-Inductive; Height - Seated (Max): 0.020" (0.51mm); LastUpdated: 2/9/2024 8:40:46 PM; Lifecycle Status: Active; Minimum Order: 1; Number of Terminations: 2; Operating Temperature: -55°C ~ 155°C; Package / Case: 0603 (1608 Metric); Packaging: TapeAndReel; PartId: 75287; Part Status: Active; Price: 0.26; Resistance: 2 kOhms; Series: PTN; Size / Dimension: 0.064" L x 0.032" W (1.63mm x 0.81mm); Supplier 1: DigiKey; Supplier Part Number 1: 764-PTN0603Y2001BST1CT-ND; Supplier Device Package: 0603; Tolerance: ±0.1%
R15 = ERA-3VRW3301V: RES 3.3K OHM 0.05% 1/8W 0603; Manufacturer: Panasonic Electronic Components; Power (Watts): 0.125W, 1/8W; Temperature Coefficient: ±10ppm/°C; Part Number: ERA-3VRW3301V; Value: 3.3 kOhms; ComponentLink1Description: Datasheet; ComponentLink1URL: https://api.pim.na.industrial.panasonic.com/file_stream/main/fileversion/9152; ComponentLink2Description: DigiKey Link; ComponentLink2URL: https://www.digikey.com/en/products/detail/panasonic-electronic-components/ERA-3VRW3301V/12086165; Composition: Thin Film; Device Package: 0603 (1608 Metric); Features: Anti-Sulfur, Automotive AEC-Q200; Height - Seated (Max): 0.022" (0.55mm); LastUpdated: 2/9/2024 8:41:00 PM; Lifecycle Status: Active; Minimum Order: 1; Number of Terminations: 2; Operating Temperature: -55°C ~ 155°C; Package / Case: 0603 (1608 Metric); Packaging: TapeAndReel; PartId: 71786; Part Status: Active; Price: 0.19; Ratings: AEC-Q200; Resistance: 3.3 kOhms; Series: ERA-3V; Size / Dimension: 0.063" L x 0.031" W (1.60mm x 0.80mm); Supplier 1: DigiKey; Supplier Part Number 1: 10-ERA-3VRW3301VCT-ND; Supplier Device Package: 0603; Tolerance: ±0.05%
U2 = CMP-04915-000037-1: IC MOTOR DRIVER 0V-5.5V 24VQFN; Interface: PWM; Case/Package: VQFN; Packaging: Tape and Reel; Mount: Surface Mount; Max Operating Temperature: 125°C; RoHS Compliant: Yes; Lead Free: Lead Free; Min Operating Temperature: -40°C

## Sheet ARM_SERVO.SchDoc: Title
size A4; Date: *******; ApprovedBy: *******; CheckedBy: None; Author: *******; CompanyName: *******; DrawnBy: Jacob Chisholm; Engineer: *******; Organization: *******; Address1: *******; Address2: *******; Address3: *******; Address4: *******; DocumentNumber: 6; Revision: *******; SheetNumber: 6; SheetTotal: 9; Address_Website: https://jchisholm204.github.io; E-Mail: JacobChisholm1010@gmail.com; CurrentTime: *******; CurrentDate: *******; Time: *******; DocumentFullPathAndName: *******; DocumentName: *******; ModifiedDate: *******; ImagePath: *******; ProjectName: *******; Application_BuildNumber: *******
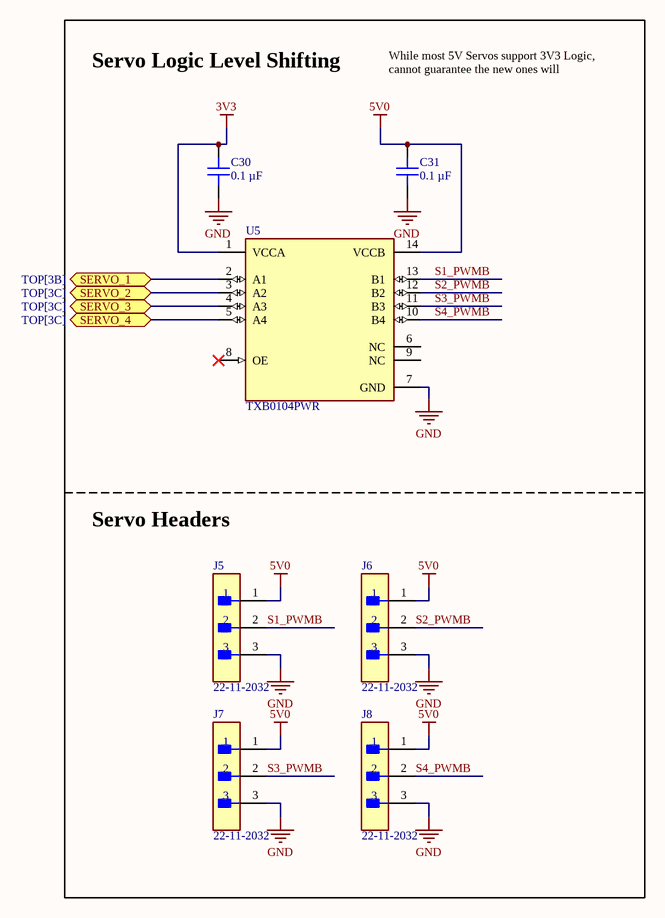
[diagram p4: ARM_SERVO.SchDoc]

### Parts
C30  0.1 µF  [CAP 0603_1608]
C31  0.1 µF  [CAP 0603_1608]
J5  22-11-2032  [FP-22-11-2032-MFG]
J6  22-11-2032  [FP-22-11-2032-MFG]
J7  22-11-2032  [FP-22-11-2032-MFG]
J8  22-11-2032  [FP-22-11-2032-MFG]
U5  TXB0104PWR  [Texas_Instruments_PW0014A_MFG]

### Ports
SERVO_1 (bidir, see TOP[3B]), SERVO_2 (bidir, see TOP[3C]), SERVO_3 (bidir, see TOP[3C]), SERVO_4 (bidir, see TOP[3C])

### Nets
3V3: C30.2 U5.1(VCCA)
5V0: C31.2 J5.1 J6.1 J7.1 J8.1 U5.14(VCCB)
GND: C30.1 C31.1 J5.3 J6.3 J7.3 J8.3 U5.7(GND)
S1_PWMB: J5.2 U5.13(B1)
S2_PWMB: J6.2 U5.12(B2)
S3_PWMB: J7.2 U5.11(B3)
S4_PWMB: J8.2 U5.10(B4)
TIM3_CH1: U5.2(A1) ; port SERVO_1
TIM3_CH2: U5.3(A2) ; port SERVO_2
TIM3_CH3: U5.4(A3) ; port SERVO_3
TIM3_CH4: U5.5(A4) ; port SERVO_4

Not connected (* = marked no-connect by the designer): U5 6(NC) 8(OE)* 9(NC)

### Notes on the sheet
- Servo Logic Level Shifting
- While most 5V Servos support 3V3 Logic, cannot guarantee the new ones will
- Servo Headers
- Title:
- Drawn By:
- Page Contents:
- Checked By:
- Size:
- Date:
- File:
- License:
- Email:
- A4
- Number:
- Time:
- Revision:
- Sheet
- Website:
- of

### Library data of the parts
C30 C31 = GMC10X7R104K25NT: as C15 on sheet ARM_Motor; Part Number: GMC10X7R104K25NT; Value: 0.1 µF; Applications: General Purpose; Capacitance: 0.1 µF; componentlink1description: Datasheet; componentlink1url: https://88ce57.p3cdn1.secureserver.net/wp-content/uploads/2023/01/gmc_series-2.pdf; componentlink2description: DigiKey Link; componentlink2url: https://www.digikey.com/en/products/detail/cal-chip-electronics-inc/GMC10X7R104K25NT/19910724; Device Package: 0603 (1608 Metric); lastupdated: 2/9/2024 8:08:39 PM; Lifecycle Status: Active; Minimum Order: 1; Mounting Type: Surface Mount, MLCC; Operating Temperature: -55°C ~ 125°C; Package / Case: 0603 (1608 Metric); packaging: TapeAndReel; partid: 56631; price: 0.01; series: GMC; Size / Dimension: 0.063" L x 0.031" W (1.60mm x 0.80mm); Supplier 1: DigiKey; Supplier Part Number 1: 4713-GMC10X7R104K25NTCT-ND; Temperature Coefficient: X7R; Thickness (Max): 0.035" (0.90mm); Tolerance: ±10%; Voltage - Rated: 25V
J5-J8 = CMP-04776-000113-1: CONN HEADER VERT 3POS 2.54MM; Manufacturer: Molex; Number Of Contacts: 3; Voltage Rating: 500V; Conn Gender: Male; Current Rating: 4A; Conn Orientation: Vertical; Device Class L2: Headers and Wire Housings; Number Of Rows: 1; Temperature Range High: +80°C; RoHS: TRUE; ComponentLink2URL: https://www.molex.com/webdocs/datasheets/pdf/en-us/0022112032_PCB_HEADERS.pdf; Manufacturer Part Number: 22-11-2032; Device Class L3: unset; Automotive: No; Temperature: -40°C to +80°C; Temperature Range Low: -40°C; Lead Free: Yes; Pitch: 2.54mm; Footprint Url: https://www.molex.com/pdm_docs/sd/022112032_sd.pdf; Digikey Description: CONN HEADER VERT 3POS 2.54MM; Contact Material: Gold,Nickel; Octopart: https://octopart.com/22-11-2032-molex-10085; Height: 10.91mm; Mouser Description: KK® 254 Solid Header, Vertical, with Friction Lock, 3 Circuits, Gold (Au) Plating; Package: 22-11-2032; Device Class L1: Connectors; Mounting Type: Through Hole; ComponentLink2Description: Datasheet; Category: Conn
U5 = CMP-2000-07335-2: NexarPartId: 1486292; Manufacturer Lifecycle Status: ACTIVE; Quiescent Current: 3.5µA; Number of Circuits: 1; Logic Function: Translator; Number of Bits: 4; Max Supply Voltage: 5.5V; Low Level Output Current: 20µA; Data Rate: 100Mbps; Nominal Supply Current: 5µA; Turn-On Delay Time: 31ns; Propagation Delay: 4ns; High Level Output Current: -20µA; Min Supply Voltage: 1.2V; Rise Time: 700ps; Max Junction Temperature (Tj): 150°C; Number of Outputs: 4; Ambient Temperature Range High: 85°C; Width: 4.4mm; Height: 1.2mm; Radiation Hardening: No; Case/Package: TSSOP; Number of Inputs: 4; Packaging: Digi-Reel®; RoHS: Compliant; Weight: 57.209338mg; Length: 5mm; REACH SVHC: No SVHC; Min Supply Voltage (DC): 1.2V; Min Operating Temperature: -40°C; Number of Channels: 4; Number of Pins: 14; Schedule B: 8542390000, 8542390000; Max Operating Temperature: 85°C; Output Current: 20µA; Thickness: 1mm; Lead Free: Lead Free; Lifecycle Status: Production; Mount: Surface Mount